# Altium schematic sheet Cover page.SchDoc
size A4; SheetNumber: 1; SheetTotal: 5
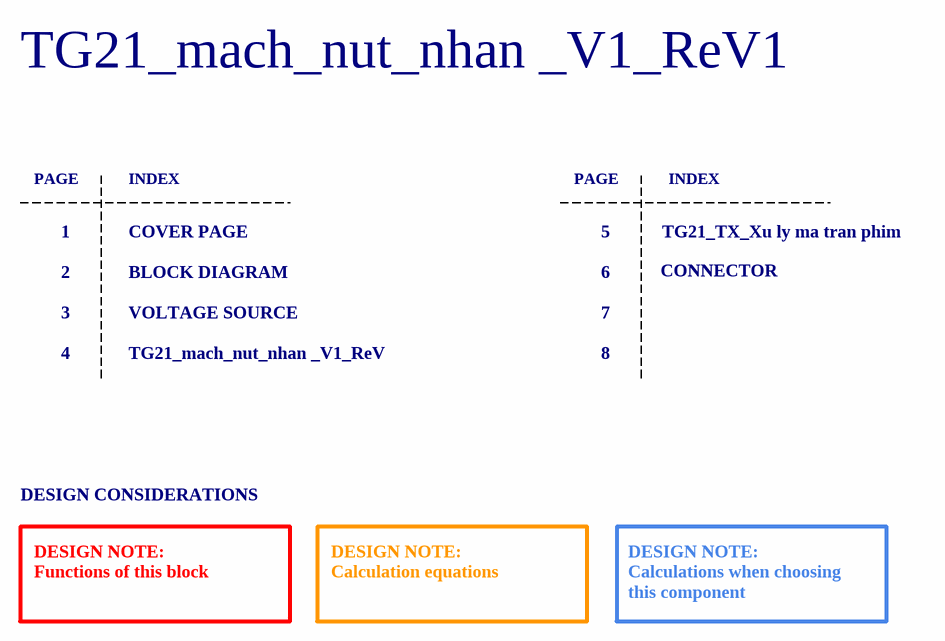
[diagram p0: Cover page.SchDoc]

## Notes on the sheet
- TG21_mach_nut_nhan _V1_ReV1
- PAGE
- INDEX
- 1
- 2
- COVER PAGE
- BLOCK DIAGRAM
- 5
- 6
- CONNECTOR
- TG21_TX_Xu ly ma tran phim
- 3
- 4
- VOLTAGE SOURCE
- TG21_mach_nut_nhan _V1_ReV
- 7
- 8
- DESIGN CONSIDERATIONS
- DESIGN NOTE:
  Functions of this block
- DESIGN NOTE:
  Calculation equations
- DESIGN NOTE:
  Calculations when choosing this component
- Author:
- Title:
- Size:
- A4
- Project:
- Approved:
- Revision:
- Modified Date:
- CONFIDENTIAL
- Date:
- SW Version: